# EAGLE schematic Schemat_v1 (EAGLE 9.7.0)
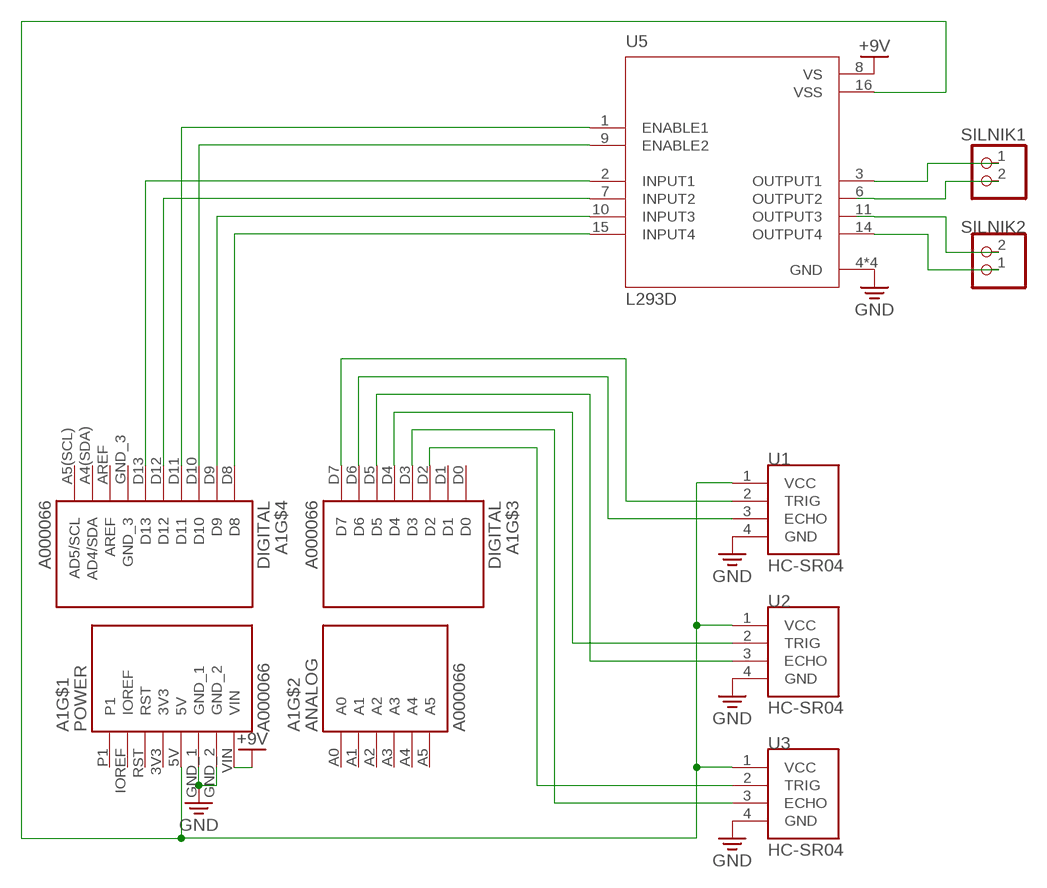
[diagram p0: schematic, sheet 1]

## Parts
A1  A000066  [ARDUINO_A000066]
SILNIK1  PINHD-1X2/90  [1X02/90]
SILNIK2  PINHD-1X2/90  [1X02/90]
U1  HC-SR04  [XCVR_HC-SR04]
U2  HC-SR04  [XCVR_HC-SR04]
U3  HC-SR04  [XCVR_HC-SR04]
U5  L293D  [DIP880W50P254L2000H510Q16]

## Nets
+9V: A1.VIN U5.8(VS)
GND: A1.GND_1 A1.GND_2 U1.4(GND) U2.4(GND) U3.4(GND) U5.4(GND) U5.5(GND) U5.12(GND) U5.13(GND)
N$1: A1.D2 U3.2(TRIG)
N$2: SILNIK1.1 U5.3(OUTPUT1)
N$3: SILNIK1.2 U5.6(OUTPUT2)
N$4: A1.D8 U5.15(INPUT4)
N$5: SILNIK2.2 U5.11(OUTPUT3)
N$6: SILNIK2.1 U5.14(OUTPUT4)
N$7: A1.D11 U5.1(ENABLE1)
N$8: A1.5V U1.1(VCC) U2.1(VCC) U3.1(VCC) U5.16(VSS)
N$9: A1.D9 U5.10(INPUT3)
N$10: A1.D12 U5.7(INPUT2)
N$11: A1.D10 U5.9(ENABLE2)
N$12: A1.D13 U5.2(INPUT1)
N$13: A1.D4 U2.2(TRIG)
N$14: A1.D5 U2.3(ECHO)
N$15: A1.D3 U3.3(ECHO)
N$16: A1.D6 U1.3(ECHO)
N$17: A1.D7 U1.2(TRIG)
Unconnected: A1.A0 A1.A1 A1.A2 A1.A3 A1.A4 A1.A4(SDA)(AD4/SDA) A1.A5 A1.A5(SCL)(AD5/SCL) A1.AREF A1.D0 A1.D1 A1.IOREF A1.P1 A1.RST

## Power pins joined to a net without a drawn wire
3V3: A1.3V3
GND_3: A1.GND_3

## Library data of the parts
A1 = A000066:A000066: Microcontroller board, Uno [Arduino] A000066 Microcontroller board, Uno 7640152110092 Check availability <https://pricing.snapeda.com/parts/A000066/Arduino/view-part?ref=eda>; AVAILABILITY: In Stock; CHECK_PRICES: https://www.snapeda.com/parts/A000066/Arduino/view-part/?ref=eda; DESCRIPTION: Arduino UNO Rev3 Microcontroller Board, ATmega328P | Arduino A000066; MF: Arduino; MP: A000066; PACKAGE: Non-Standard Arduino; PRICE: None; PURCHASE-URL: https://www.snapeda.com/api/url_track_click_mouser/?unipart_id=7027813&manufacturer=Arduino&part_name=A000066&search_term=None; SNAPEDA_LINK: https://www.snapeda.com/parts/A000066/Arduino/view-part/?ref=snap
SILNIK1 SILNIK2 = Connector:PINHD-1X2: PIN HEADER; CATEGORY: CONNECTOR; SUB-CATEGORY: PIN-HEADER
U1-U3 = HC-SR04:HC-SR04: Ultrasonic Sensor Module Check availability <https://pricing.snapeda.com/parts/HC-SR04/SparkFun%20Electronics/view-part?ref=eda>; AVAILABILITY: Not in stock; CHECK_PRICES: https://www.snapeda.com/parts/HC-SR04/SparkFun+Electronics/view-part/?ref=eda; DESCRIPTION: HC-SR04 Ultrasonic Sensor Qwiic Platform Evaluation Expansion Board; MF: SparkFun Electronics; MP: HC-SR04; PACKAGE: None; PRICE: None; SNAPEDA_LINK: https://www.snapeda.com/parts/HC-SR04/SparkFun+Electronics/view-part/?ref=snap
U5 = L293D:L293D: 4-Channel Motor Driver 24V 16-Pin Power PDIP Tube Check availability <https://pricing.snapeda.com/parts/L293D/STMicroelectronics/view-part?ref=eda>; AVAILABILITY: In Stock; CHECK_PRICES: https://www.snapeda.com/parts/L293D/STMicroelectronics/view-part/?ref=eda; DESCRIPTION: Bipolar Motor Driver - Parallel 16-PowerDIP; MF: STMicroelectronics; MP: L293D; PACKAGE: DIP-16 STMicroelectronics; PRICE: None; PURCHASE-URL: https://www.snapeda.com/api/url_track_click_mouser/?unipart_id=3077057&manufacturer=STMicroelectronics&part_name=L293D&search_term=None; SNAPEDA_LINK: https://www.snapeda.com/parts/L293D/STMicroelectronics/view-part/?ref=snap